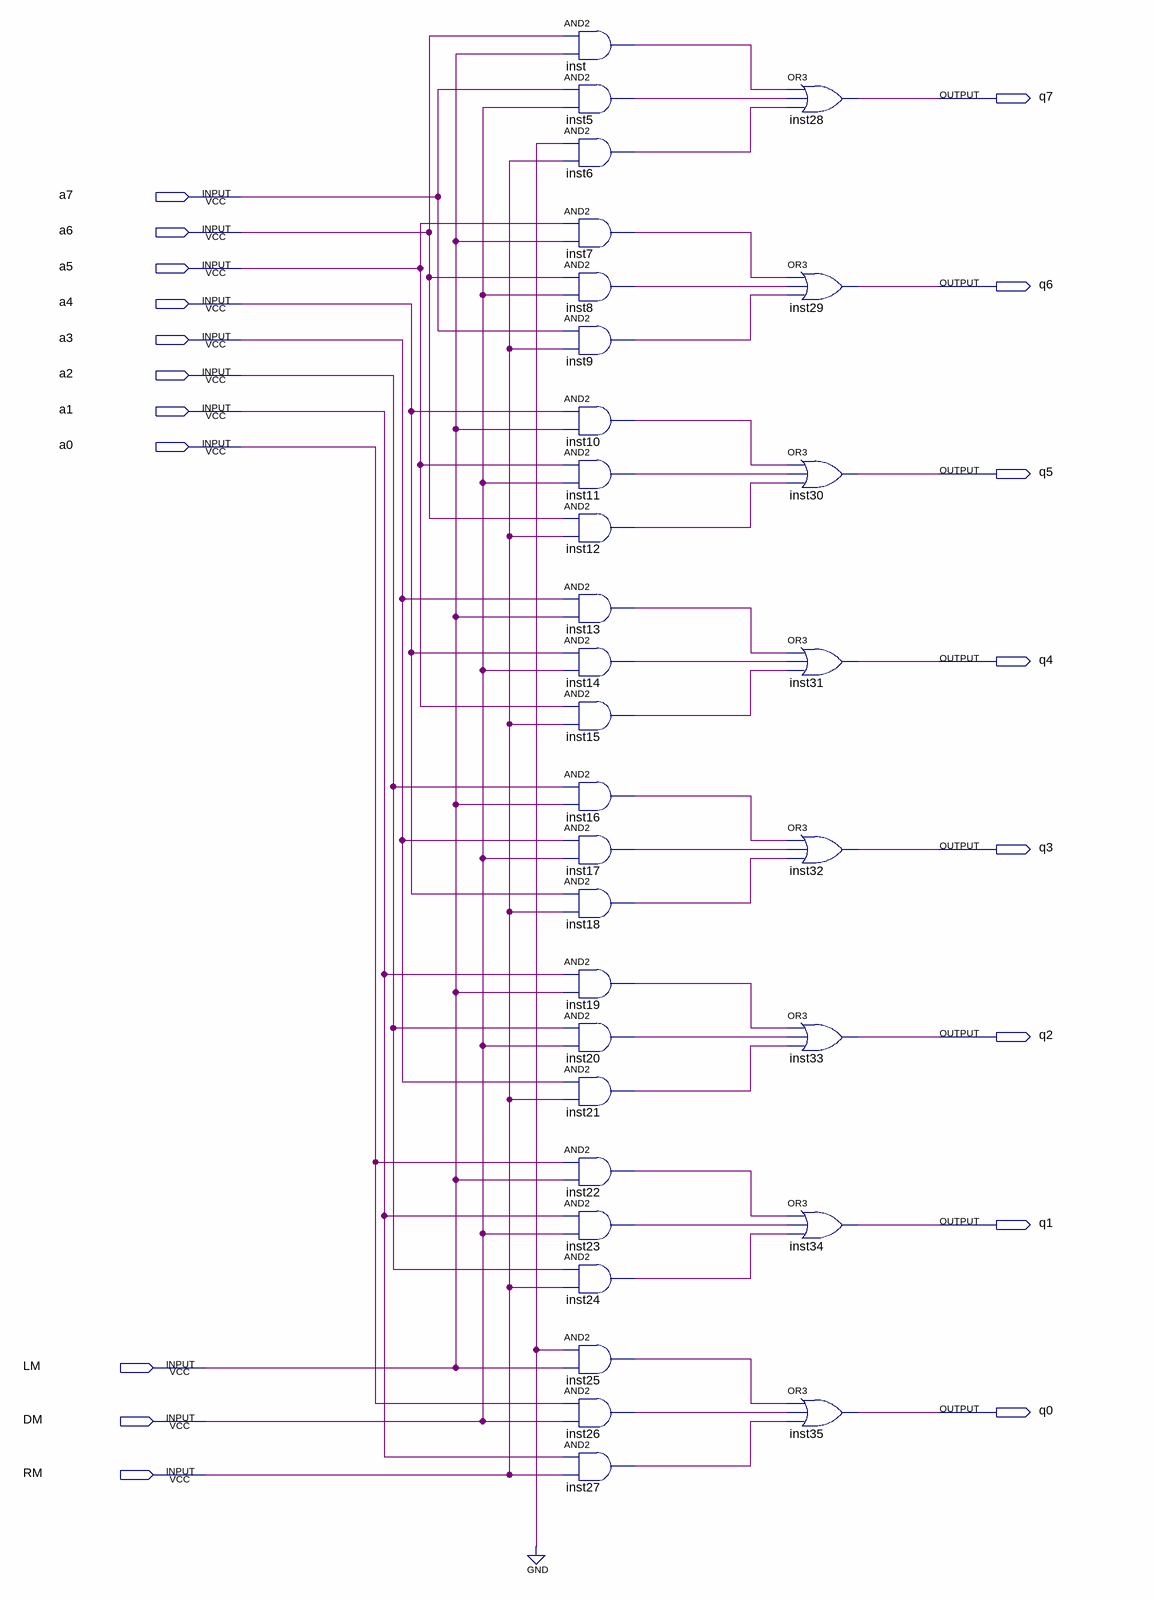
[diagram p0: schematic sheet]
// Quartus schematic My_8_bit_shifter.bdf as structural Verilog: 32 symbols, 19 pins
module My_8_bit_shifter (
  input  a7,
  input  a6,
  input  a5,
  input  a4,
  input  a3,
  input  a2,
  input  a1,
  input  a0,
  input  LM,
  input  DM,
  input  RM,
  output q7,
  output q6,
  output q5,
  output q4,
  output q3,
  output q2,
  output q1,
  output q0
);

  wire inst5_out, inst6_out, inst7_out, inst8_out, inst9_out, inst10_out, inst11_out, inst12_out, inst13_out,
       inst14_out, inst15_out, inst16_out, inst17_out, inst18_out, inst19_out, inst20_out, inst21_out,
       inst22_out, inst23_out, inst24_out, inst25_out, inst26_out, inst27_out, inst_out;

  and inst (inst_out, a6, LM);
  and inst5 (inst5_out, a7, DM);
  and inst6 (inst6_out, 1'b0, RM);
  and inst7 (inst7_out, a5, LM);
  and inst8 (inst8_out, a6, DM);
  and inst9 (inst9_out, a7, RM);
  and inst10 (inst10_out, a4, LM);
  and inst11 (inst11_out, a5, DM);
  and inst12 (inst12_out, a6, RM);
  and inst13 (inst13_out, a3, LM);
  and inst14 (inst14_out, a4, DM);
  and inst15 (inst15_out, a5, RM);
  and inst16 (inst16_out, a2, LM);
  and inst17 (inst17_out, a3, DM);
  and inst18 (inst18_out, a4, RM);
  and inst19 (inst19_out, a1, LM);
  and inst20 (inst20_out, a2, DM);
  and inst21 (inst21_out, a3, RM);
  and inst22 (inst22_out, a0, LM);
  and inst23 (inst23_out, a1, DM);
  and inst24 (inst24_out, a2, RM);
  and inst25 (inst25_out, 1'b0, LM);
  and inst26 (inst26_out, a0, DM);
  and inst27 (inst27_out, a1, RM);
  or inst28 (q7, inst_out, inst5_out, inst6_out);
  or inst29 (q6, inst7_out, inst8_out, inst9_out);
  or inst30 (q5, inst10_out, inst11_out, inst12_out);
  or inst31 (q4, inst13_out, inst14_out, inst15_out);
  or inst32 (q3, inst16_out, inst17_out, inst18_out);
  or inst33 (q2, inst19_out, inst20_out, inst21_out);
  or inst34 (q1, inst22_out, inst23_out, inst24_out);
  or inst35 (q0, inst25_out, inst26_out, inst27_out);
endmodule
